# EAGLE design ECG_V3 (EAGLE 6.5.0)
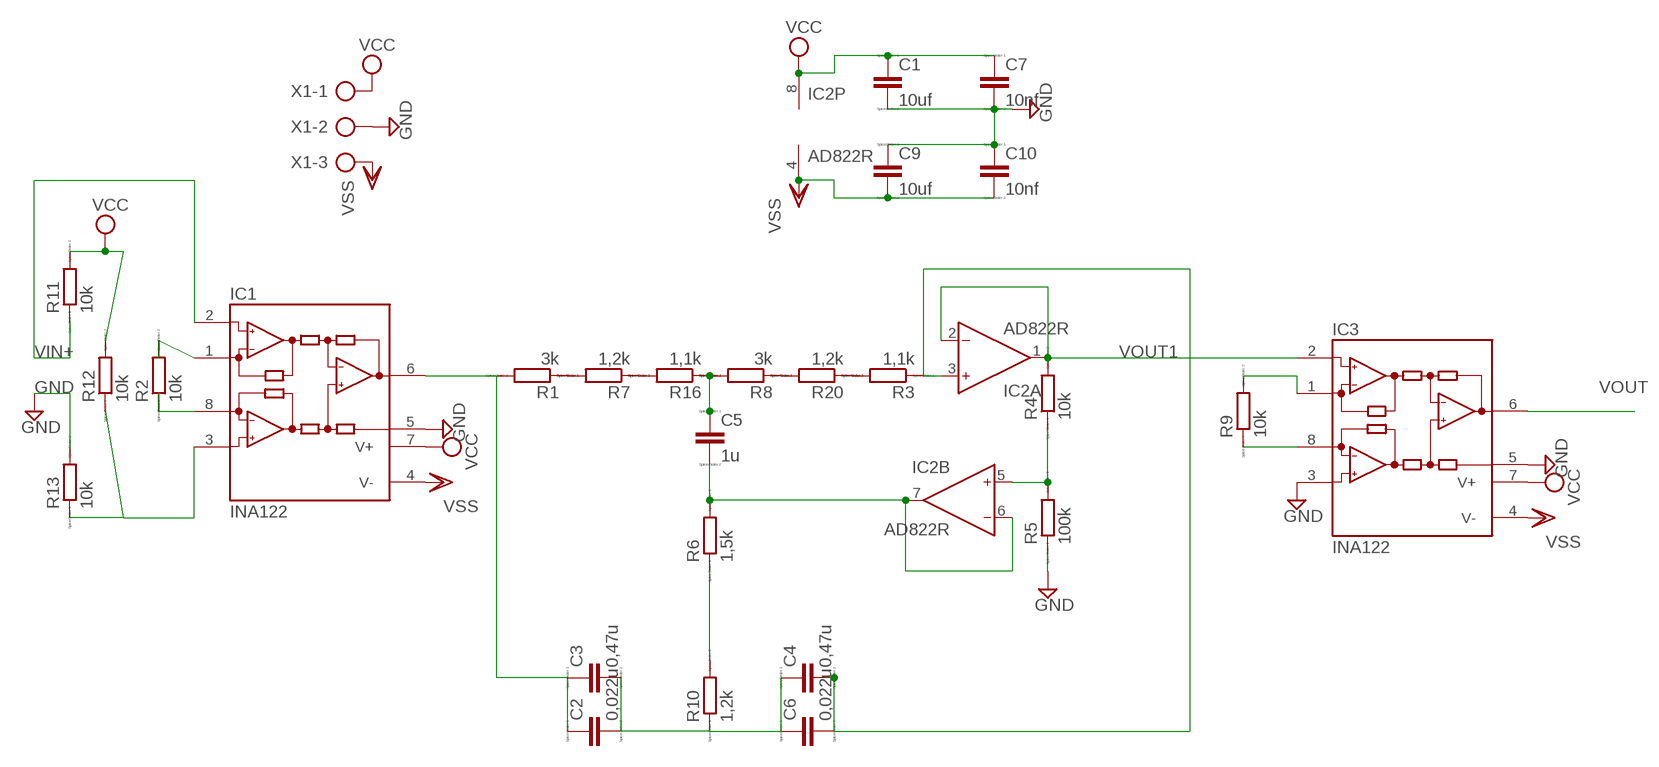
[diagram p0: schematic, sheet 1]

## Parts
C1  10uf  CC0603  [C0603]
C2  0,022u  CC0603  [C0603]
C3  0,47u  CC0603  [C0603]
C4  0,47u  CC0603  [C0603]
C5  1u  CC0603  [C0603]
C6  0,022u  CC0603  [C0603]
C7  10nf  CC0603  [C0603]
C9  10uf  CC0603  [C0603]
C10  10nf  CC0603  [C0603]
IC1  INA122  INA118U  [SO08]
IC2  AD822R  [SO8]
IC3  INA122  INA118U  [SO08]
R1  3k  RR0603  [R0603]
R2  10k  RR0603  [R0603]
R3  1,1k  RR0603  [R0603]
R4  10k  RR0603  [R0603]
R5  100k  RR0603  [R0603]
R6  1,5k  RR0603  [R0603]
R7  1,2k  RR0603  [R0603]
R8  3k  RR0603  [R0603]
R9  10k  RR0603  [R0603]
R10  1,2k  RR0603  [R0603]
R11  10k  RR0603  [R0603]
R12  10k  RR0603  [R0603]
R13  10k  RR0603  [R0603]
R16  1,1k  RR0603  [R0603]
R20  1,2k  RR0603  [R0603]
X1  AK300/3  [AK300/3]

## Nets
GND: C1.2 C7.2 C9.1 C10.1 IC1.5(REF) IC3.3(+IN) IC3.5(REF) R5.1 R13.2 X1.2
N$1: IC3.1(RG) R9.2
N$2: IC3.8(RG) R9.1
N$3: IC1.1(RG) R2.2
N$4: IC1.8(RG) R2.1
N$5: R1.1 R7.2
N$6: R7.1 R16.2
N$7: R3.2 R20.1
N$8: IC2.5(B:IN+) R4.1 R5.2
N$9: R8.1 R20.2
N$10: C5.2 IC2.6(B:IN-) IC2.7(B:OUT) R6.2
N$11: C5.1 R8.2 R16.1
N$13: IC1.3(+IN) R12.1 R13.1
N$14: R6.1 R10.2
N$16: C2.2 C3.2 C4.1 C6.1 R10.1
N$17: C2.1 C3.1 IC1.6(OUT) R1.2
N$18: C4.2 C6.2 IC2.3(A:IN+) R3.1
VCC: C1.1 C7.1 IC1.7(V+) IC2.8(P:V+) IC3.7(V+) R11.2 R12.2 X1.1
VIN+: IC1.2(-IN) R11.1
VOUT: IC3.6(OUT)
VOUT1: IC2.1(A:OUT) IC2.2(A:IN-) IC3.2(-IN) R4.2
VSS: C9.2 C10.2 IC1.4(V-) IC2.4(P:V-) IC3.4(V-) X1.3

## Library data of the parts
C1-C7 C9 C10 = eagle-ltspice:C: CAPACITOR, European symbol; SPICEMODEL: NONE; SPICEPREFIX: C
IC1 IC3 = burr-brown:INA118: Instrumentation Amplifier Precision, Low Power; MF: TEXAS INSTRUMENTS; MPN: INA118U; OC_FARNELL: 1212404; OC_NEWARK: 04M6168
IC2 = analog-devices:AD822: Single-Supply, Rail-to-Rail Low Power FET-Input Op Amp Source: http://www.analog.com/static/imported-files/data_sheets/AD822.pdf; MF: ANALOG DEVICES; MPN: AD822BRZ; OC_FARNELL: 1651303
R1-R13 R16 R20 = eagle-ltspice:R: RESISTOR, European symbol; SPICEMODEL: NONE; SPICEPREFIX: R
X1 = con-ptr500:AK300/3: CONNECTOR; OC_FARNELL: unknown; OC_NEWARK: unknown

## Board
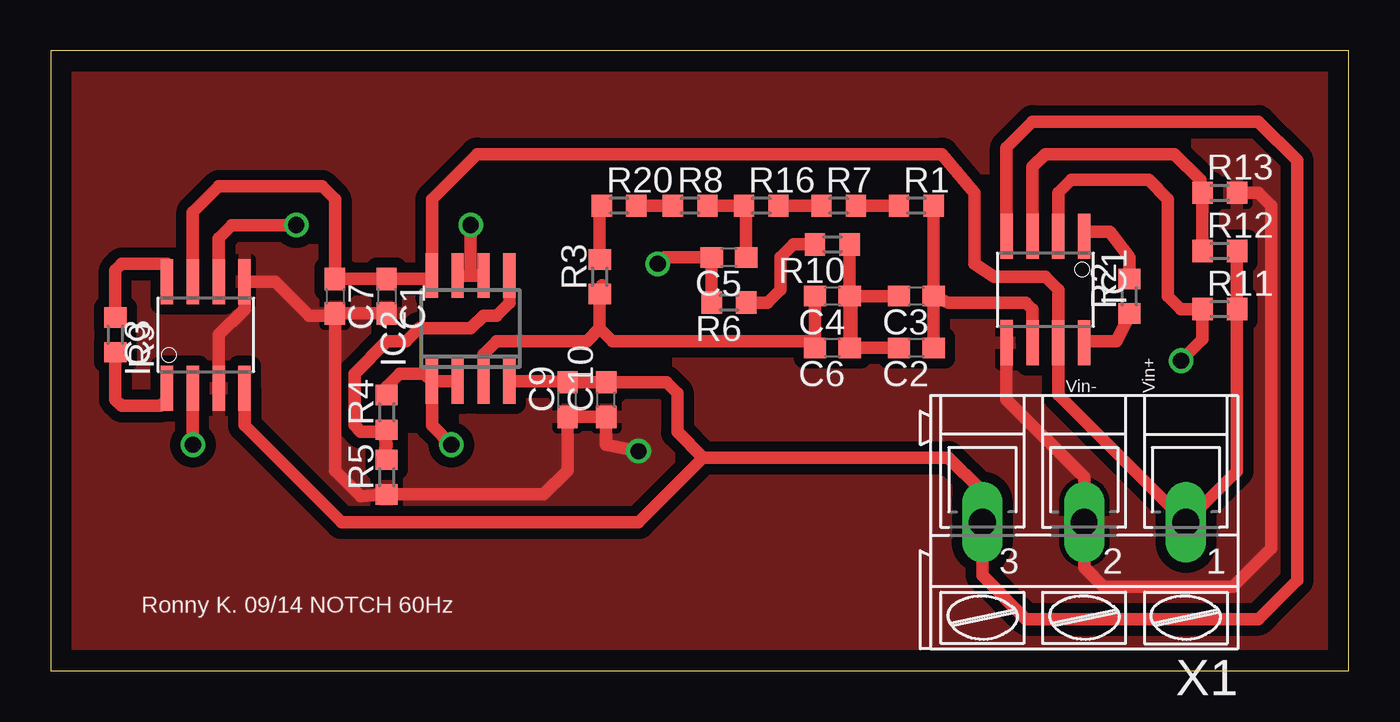
[diagram p1: board, top side]
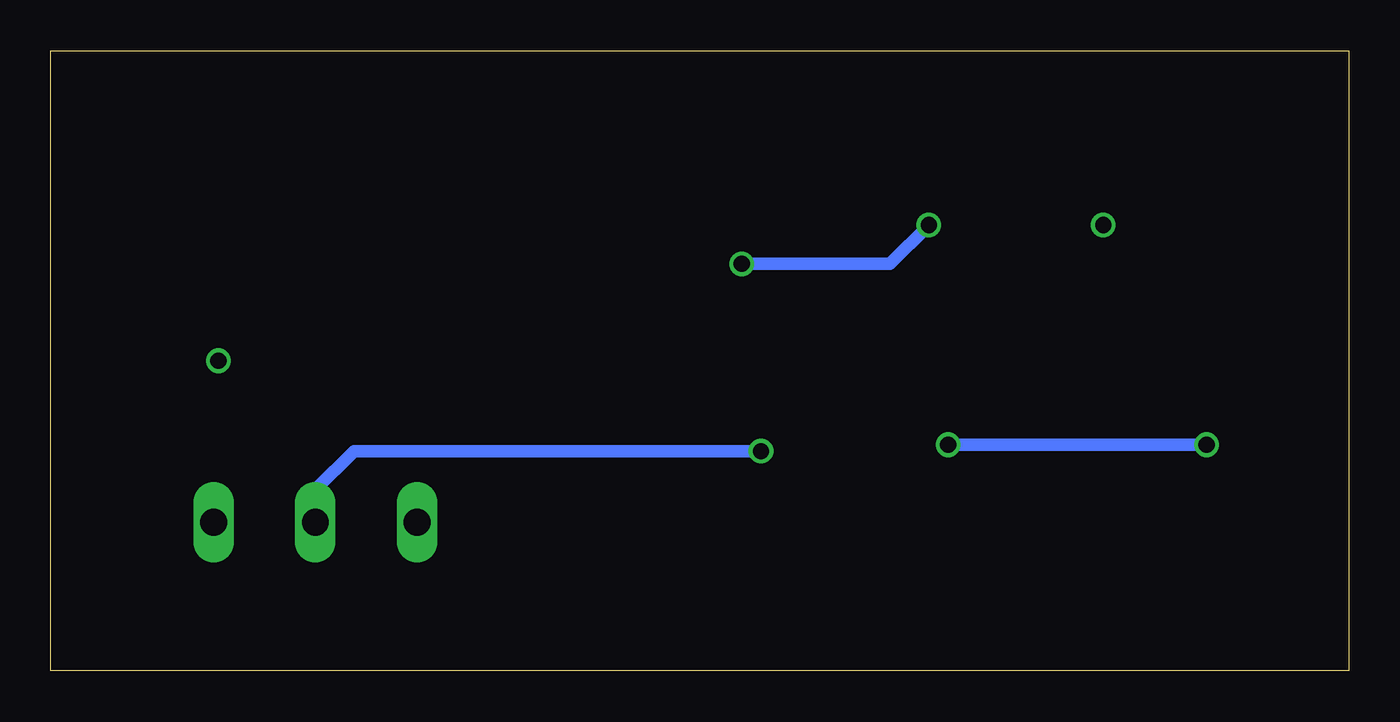
[diagram p2: board, bottom side, seen from below]

Size 63.8 x 30.47 mm. Coordinates in mm from the lower left corner, seen from the top.
Outline: 0,0 63.8,0 63.8,30.47 0,30.47 0,0
Copper layers (1*16): Top 0.035mm / dielectric 1.5mm / Bottom 0.035mm
Design rules "default *": minimum track width 10mil, minimum drill 24mil, track to track 20mil, track to pad 20mil, pad to pad 20mil, via to via 20mil, smd to smd 20mil, copper to edge 40mil, drill to drill 8mil, minimum pad ring 10mil, minimum via ring 8mil, stop-mask expansion 4mil, vias tented up to drill 0mil, thermal gap 10mil

### Footprints (pad centres in the part's own frame; a part is rotated, then mirrored left to right if it is on the bottom)
C0603 = smd 1.1 x 1: 1 -0.85,0; 2 0.85,0
SO08 = smd 0.61 x 2.21: 1 -1.905,-2.616; 2 -0.635,-2.616; 3 0.635,-2.616; 4 1.905,-2.616; 5 1.905,2.616; 6 0.635,2.616; 7 -0.635,2.616; 8 -1.905,2.616
SO8 = smd 0.6 x 2.2: 1 -1.905,-2.6; 2 -0.635,-2.6; 3 0.635,-2.6; 4 1.905,-2.6; 5 1.905,2.6; 6 0.635,2.6; 7 -0.635,2.6; 8 -1.905,2.6
R0603 = smd 1 x 1.1: 1 -0.85,0; 2 0.85,0
AK300/3 = drill 1.321 long: 1 -5.004,0; 2 0,0; 3 5.004,0

### Placement (x,y rotation side)
C1  16.51,18.41 270 top
C2  42.55,15.88 180 top
C3  42.55,18.41 180 top
C4  38.42,18.41 180 top
C5  33.34,20.32 180 top
C6  38.42,15.88 180 top
C7  13.97,18.41 270 top
C9  25.4,13.34 90 top
C10  27.3,13.34 90 top
IC1  48.9,18.73 180 top
IC2  20.64,16.83 0 top
IC3  7.62,16.51 0 top
R1  42.55,22.86 0 top
R2  53.02,18.41 90 top
R3  26.99,19.37 90 top
R4  16.51,12.7 90 top
R5  16.51,9.53 90 top
R6  33.34,18.1 180 top
R7  38.73,22.86 0 top
R8  31.43,22.86 0 top
R9  3.17,16.51 270 top
R10  38.42,20.95 180 top
R11  57.47,17.78 0 top
R12  57.47,20.64 0 top
R13  57.47,23.5 0 top
R16  34.92,22.86 0 top
R20  27.94,22.86 0 top
X1  50.8,7.3 180 top

### Tracks (layer width: path | path; a pad name or v marks a point on that pad's centre or on a via)
GND  (via drill 0.8 pad 1.02)
  Top 0.61: C7.2 C1.2 | C9.1 C10.1 27.3,11.11 v28.89,10.79 | C9.1 25.61,12.48 25.72,12.38 | C7.2 13.97,9.84 15.24,8.57 R5.1 24.23,8.68 25.4,9.84 C9.1 | IC1.5 46.99,13.34 50.8,9.53 X1.2 50.8,5.08 51.75,4.13 58.1,4.13 60.01,6.03 60.01,22.86 59.37,23.5 R13.2 | IC3.3 8.26,16.51 9.53,17.78 IC3.5 11.04,19.13 12.7,17.46 13.87,17.46 C7.2
  Bottom 0.61: v28.89,10.79 48.9,10.79 50.8,8.89 X1.2
  pour Top: 0,30.48 63.82,30.48 63.82,0 0,0
N$1
  Top 0.61: R9.2 3.17,13.34 3.49,13.02 5.4,13.02 5.71,13.34 IC3.1
N$2
  Top 0.61: R9.1 3.17,19.68 3.49,20 5.71,20 IC3.8
N$3
  Top 0.61: R2.2 53.02,20.32 52.07,21.59 50.8,21.59 IC1.1
N$4
  Top 0.61: R2.1 53.02,17.46 52.39,16.19 50.8,16.19 IC1.8
N$5
  Top 0.61: R1.1 R7.2
N$6
  Top 0.61: R7.1 R16.2
N$7
  Top 0.61: R20.1 26.99,22.86 R3.2
N$8
  Top 0.61: R5.2 16.41,11.85 16.51,11.11 16.41,10.48 R4.1 16.09,11.75 15.24,11.75 14.92,12.06 14.92,14.61 16.51,16.19 17.46,16.19 18.1,16.83 20.64,16.83 21.27,17.46 21.91,17.46 22.54,18.1 IC2.5
N$9
  Top 0.61: R8.1 R20.2
N$10  (via drill 0.8 pad 1.02)
  Top 0.61: IC2.7 20.64,19.43 | 20.64,19.43 IC2.6 | R6.2 C5.2 30.16,20.32 v29.84,20 | 20.64,19.43 v20.64,21.91
  Bottom 0.61: v29.84,20 22.54,20 v20.64,21.91
N$11
  Top 0.61: R8.2 R16.1 34.19,22.75 C5.1
N$13
  Top 0.61: IC1.3 48.26,24.77 48.9,25.4 55.24,25.4 56.52,24.13 56.52,23.6 R13.1 R12.1
N$14
  Top 0.61: R6.1 35.24,18.1 35.88,18.73 35.88,20.32 36.51,20.95 R10.2
N$16
  Top 0.61: C2.2 C6.1 | C4.1 39.37,18.41 | 39.37,18.41 39.37,15.98 C6.1 | 39.37,18.41 C3.2 | R10.1 C6.1
N$17
  Top 0.61: C3.1 C2.1 | IC1.6 48.26,17.78 47.94,18.1 44.13,18.1 C3.1 | R1.2 C3.1
N$18
  Top 0.61: C4.2 C6.2 37.25,16.19 27.62,16.19 26.99,16.83 | IC2.3 21.27,15.56 21.91,16.19 26.35,16.19 26.99,16.83 | R3.1 27.09,18.95 26.99,18.73 26.99,16.83
VCC
  Top 0.61: IC3.7 6.99,22.54 8.26,23.81 13.34,23.81 13.97,23.18 13.97,20.95 13.97,20.32 C7.1 C1.1 18.57,19.27 IC2.8 18.73,23.18 20.95,25.4 43.81,25.4 45.4,23.5 45.4,20 46.35,19.37 48.9,19.37 49.53,18.73 IC1.7 49.53,13.58 X1.1 58.32,9.82 R11.2 R12.2
VIN+  (via drill 0.8)
  Top 0.61: IC1.2 49.53,23.5 50.16,24.13 53.98,24.13 54.93,23.18 54.93,18.41 55.56,17.78 R11.1 56.62,16.3 v55.56,15.24
VOUT  (via drill 0.8)
  Top 0.61: IC3.6 8.26,21.27 8.89,21.91 v12.06,21.91
VOUT1  (via drill 0.8 pad 1.02)
  Top 0.61: 18.36,14.61 17.14,14.61 16.51,13.97 R4.2 | 18.36,14.61 IC2.1 IC2.2 | 18.36,14.61 18.41,14.61 18.73,14.29 18.73,12.06 v19.68,11.11 | v6.99,11.11 IC3.2
  Bottom 0.61: v19.68,11.11 v6.99,11.11
VSS
  Top 0.61: IC2.4 24.6,14.23 C9.2 C10.2 30.27,14.19 30.8,13.65 30.8,11.75 32.07,10.48 | X1.3 45.8,6.67 | 32.07,10.48 44.13,10.48 45.72,8.89 45.72,6.74 45.8,6.67 | 45.8,6.67 45.8,4.69 47.94,2.54 59.37,2.54 61.28,4.45 61.28,25.08 59.37,26.99 48.26,26.99 46.99,25.72 IC1.4 | IC3.4 9.53,12.06 14.29,7.3 28.89,7.3 32.07,10.48

### Text on the board
tNames: Vin- | Vin+ | Ronny K. 09/14 NOTCH 60Hz